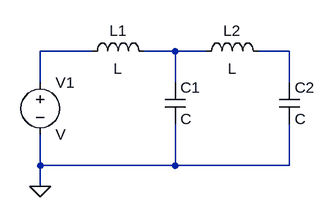
[diagram p0: schematic ejercicio1c.asc]
ejercicio1c.asc, the LTspice schematic file:
Version 4.1
SHEET 1 880 680
WIRE 160 112 80 112
WIRE 288 112 240 112
WIRE 336 112 288 112
WIRE 464 112 416 112
WIRE 80 160 80 112
WIRE 288 160 288 112
WIRE 464 160 464 112
WIRE 80 288 80 240
WIRE 288 288 288 224
WIRE 288 288 80 288
WIRE 464 288 464 224
WIRE 464 288 288 288
WIRE 80 320 80 288
FLAG 80 320 0
SYMBOL voltage 80 144 R0
SYMATTR InstName V1
SYMBOL ind 144 128 R270
WINDOW 0 32 56 VTop 2
WINDOW 3 5 56 VBottom 2
SYMATTR InstName L1
SYMBOL ind 320 128 R270
WINDOW 0 32 56 VTop 2
WINDOW 3 5 56 VBottom 2
SYMATTR InstName L2
SYMBOL cap 272 160 R0
SYMATTR InstName C1
SYMBOL cap 448 160 R0
SYMATTR InstName C2

The netlist it stands for:
* ejercicio1c.asc
V1 N001 0 V
L1 N001 N002 L
L2 N002 N003 L
C1 N002 0 C
C2 N003 0 C
.backanno
.end